# EAGLE design V2_Piezoelectric (EAGLE 9.6.2)
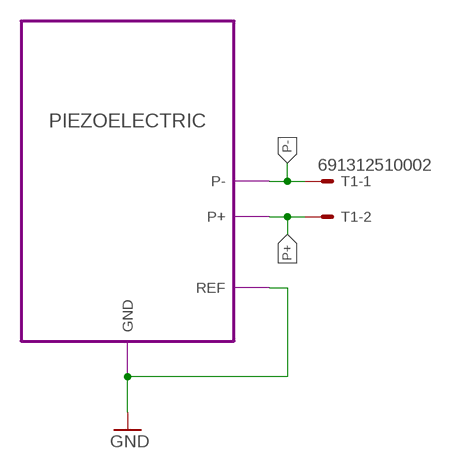
[diagram p0: schematic, sheet 1]

## Parts
T1  691312510002  [691312510002]

## Module instances
PIEZOELECTRIC = PIEZOELECTRIC

## Nets
GND: port PIEZOELECTRIC.GND PIEZOELECTRIC.REF
P+: T1.2 ; port PIEZOELECTRIC.P+
P-: T1.1 ; port PIEZOELECTRIC.P-

## Library data of the parts
T1 = msrm:691312510002: 2 Position Terminal Block Header, Male Pins, Shrouded (2 Side) 0.200" (5.08mm) 90°, Right Angle Through Hole Source: Digikey <https://www.digikey.de/products/de?keywords=732-2064-ND%20> ; Datasheet <https://www.we-online.de/katalog/datasheet/6913125100xx.pdf>; DIGIKEY: 732-2064-ND; PINS: 2

## Module PIEZOELECTRIC
Ports: GND(pwr) P+(io) P-(io) REF(io)
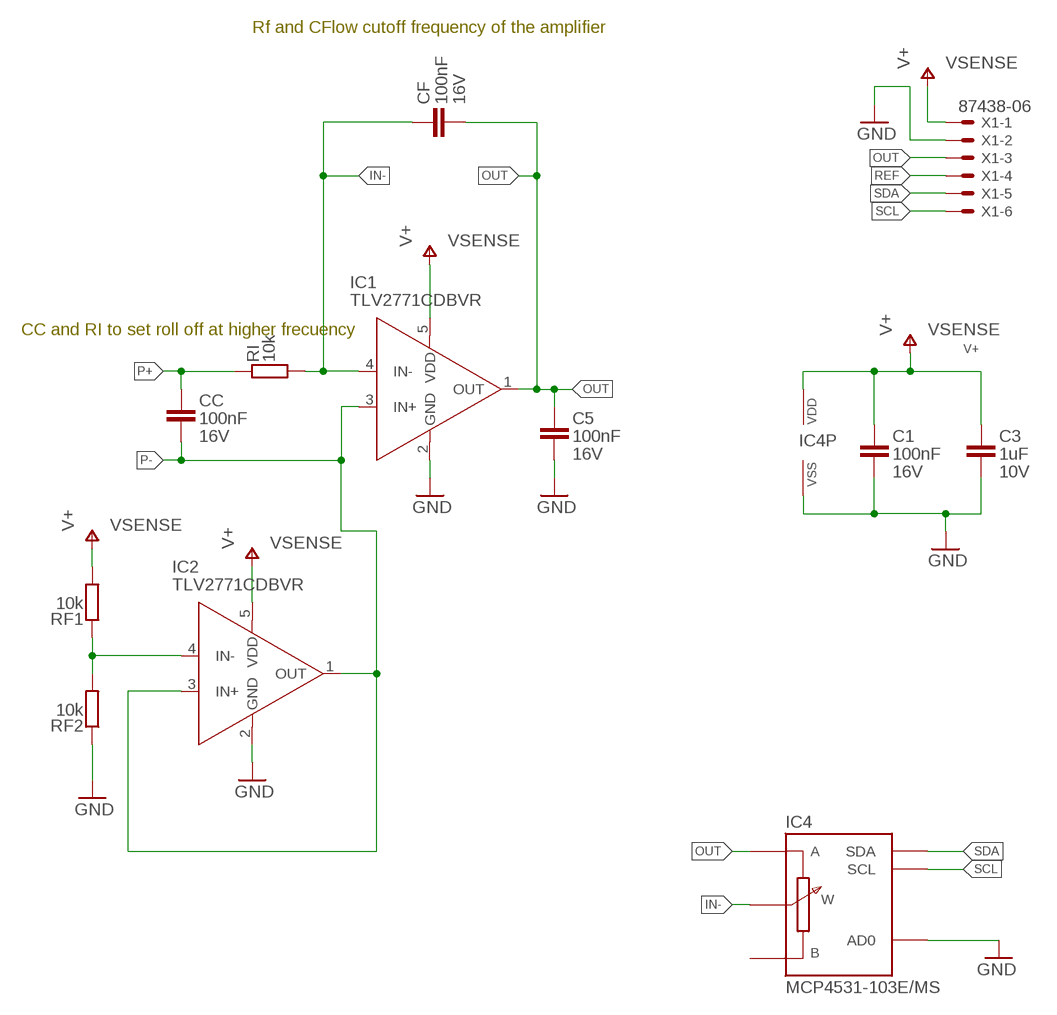
[diagram p1: schematic, module PIEZOELECTRIC, sheet 1]

### Parts
C1  GCM155R71C104JA55  [C0402]
C3  GCM155C7  GCM155C71A105KE38D  [C0402]
C5  GCM155R71C104JA55  [C0402]
CC  GCM155R71C104JA55  [C0402]
CF  GCM155R71C104JA55  [C0402]
IC1  TLV2771CDBVR  [SOT95P280X145-5N]
IC2  TLV2771CDBVR  [SOT95P280X145-5N]
IC4  MCP4531-103E/MS  [MSOP8]
RF1  10k  RT0402FRE0710KL  [R0402]
RF2  10k  RT0402FRE0710KL  [R0402]
RI  10k  RT0402FRE0710KL  [R0402]
X1  87438-06  [87438-06]

### Nets
GND: C1.2 C3.2 C5.2 IC1.2(GND) IC2.2(GND) IC4.1(AD0) IC4.4(VSS) RF2.1 X1.2
IN-: CF.1 IC1.4(IN-) IC4.6(W) RI.2
N$3: IC2.4(IN-) RF1.1 RF2.2
OUT: C5.1 CF.2 IC1.1(OUT) IC4.5(A) X1.3
P+: CC.1 RI.1
P-: CC.2 IC1.3(IN+) IC2.1(OUT) IC2.3(IN+)
REF: X1.4
SCL: IC4.2(SCL) X1.6
SDA: IC4.3(SDA) X1.5
V+ [Power]: C1.1 C3.1 IC1.5(VDD) IC2.5(VDD) IC4.8(VDD) RF1.2 X1.1
Unconnected: IC4.7(B)

### Notes on the sheet
- Rf and CFlow cutoff frequency of the amplifier
- CC and RI to set roll off at higher frecuency

### Library data of the parts
C1 C5 CC CF = msrm:GCM?R7*: Multilayer Ceramic Capacitors Chip Multilayer Ceramic Capacitors for Automotive –55 to 125°C Sources: Catalogue <https://www.murata.com/~/media/webrenewal/support/library/catalog/products/capacitor/mlcc/c03e.ashx?la=en-us> Part Numbering <https://search.murata.co.jp/Ceramy/image/img/A01X/partnumbering_e_02.pdf>; CAPACITANCE: 100nF; DIGIKEY: 490-16433-1-ND; TOLERANCE: ±5%; VOLTAGE: 16V
C3 = msrm:GCM?C7*: Multilayer Ceramic Capacitors Chip Multilayer Ceramic Capacitors for Automotive Sources: Catalogue <https://www.murata.com/~/media/webrenewal/support/library/catalog/products/capacitor/mlcc/c03e.ashx?la=en-us> Part Numbering <https://search.murata.co.jp/Ceramy/image/img/A01X/partnumbering_e_02.pdf>; CAPACITANCE: 1uF; DIGIKEY: 490-13409-1-ND; TOLERANCE: ±10%; VOLTAGE: 10V
IC1 IC2 = msrm:TLV2771CDBVR: Single 2.7-V High Slew Rate Rail-to-Rail Output Operational Amplifier Source: Datasheet <http://www.ti.com/lit/gpn/tlv2771>; DESCRIPTION: Single 2.7-V High Slew Rate Rail-to-Rail Output Operational Amplifier; HEIGHT: 1.45mm; MANUFACTURER_NAME: Texas Instruments; MANUFACTURER_PART_NUMBER: TLV2771CDBVR; MOUSER_PART_NUMBER: 595-TLV2771CDBVR; MOUSER_PRICE-STOCK: https://www.mouser.co.uk/ProductDetail/Texas-Instruments/TLV2771CDBVR?qs=Fg5TsMy7H4uETShD0%252BZIjw%3D%3D
IC4 = msrm:MCP4531-*E/?: Digital Potentiometer I²C Interface Source: Datasheet <http://www.microchip.com/mymicrochip/filehandler.aspx?ddocname=en544078>; DIGIKEY: MCP4531-103E/MS-ND; MEMORY: RAM; POR_WIPER_SETTING: MID SCALE; RESISTANCE: 10k; STEPS: 129; SUPPLY_VOLTAGE: 1.8V to 5.5V; WIPER_LOCK: NO; WIPER_RESISTANCE: 75
RF1 RF2 RI = msrm:RT?FRE07*L: SMD RESISTOR ± 1% Tol, Paper/PE taping reel, 50 ppm/°C, 7 inch dia. Reel Datasheet <http://www.yageo.com/documents/recent/PYu-RT_1-to-0.01_RoHS_L_11.pdf> package: 0201 : 0R ___ Source: Digikey <https://www.digikey.de/products/en?keywords=311-0.0MCT-ND> 1k ___ Source: Digikey <https://www.digikey.de/products/en?keywords=RT0201FRE071KL-ND> 10k ___ Source: Digikey <https://www.digikey.de/products/en?keywords=RT0201FRE0710KL-ND> 100 ___ Source: Digikey <https://www.digikey.de/products/en?keywords=RT0201FRE07100RL-ND> 330 ___ Source: Digikey <https://www.digikey.de/products/en?keywords=RT0201FRE07330RL-ND> package: 0402 : 0R ___ Source: Digikey <https://www.digikey.de/products/en?keywords=311-0.0LRCT-ND> 1k ___ Source: Digikey <https://www.digikey.de/products/en?keywords=%20YAG1234CT-ND> 2k2 ___ Source: Digikey <https://www.digikey.de/products/en?keywords=RT0402FRE072K2L-ND> 2k ___ Source: Digikey <https://www.digikey.de/products/en?keywords=YAG3345CT-ND> 4k7 ___ Source: Digikey <https://www.digikey.de/products/en?keywords=YAG3347CT-ND%20> 10k ___ Source: Digikey <https://www.digikey.de/products/en?keywords=YAG1233CT-ND> 12k1 ___ Source: Digikey <https://www.digikey.de/products/en?keywords=RT0402FRE0712K1L-ND> 49R9 ___ Source: Digikey <https://www.digikey.de/products/en?keywords=YAG3346CT-ND> 56k ___ Source: Digikey <https://www.digikey.de/products/en?keywords=RT0402FRE0756K2L-ND> 100k ___ Source: Digikey <https://www.digikey.de/products/en?keywords=YAG2307CT-ND> 100 ___ Source: Digikey <https://www.digikey.de/products/en?keywords=YAG3342CT-ND> 150 ___ Source: Digikey <https://www.digikey.de/product-detail/en/yageo/RT0402FRE07150RL/13-RT0402FRE07150RLCT-ND/12705162> 300 ___ Source: Digikey <https://www.digikey.de/products/en?keywords=RT0402FRE07300RL-ND> package: 0603 : 0R ___ Source: Digikey <https://www.digikey.de/products/en?keywords=311-0.0HRCT-ND> 1k ___ Source: Digikey <https://www.digikey.de/products/en?keywords=YAG2323CT-ND> 10k ___ Source: Digikey <https://www.digikey.de/products/en?keywords=YAG2321CT-ND> 100k ___ Source: Digikey <https://www.digikey.de/products/en?keywords=YAG2319CT-ND> 100 ___ Source: Digikey <https://www.digikey.de/products/en?keywords=YAG2320CT-ND> 300 ___ Source: Digikey <https://www.digikey.de/products/en?keywords=RT0603FRE07300RL-ND> 330 ___ Source: Digikey <https://www.digikey.de/products/en?keywords=YAG5957CT-ND>; DIGIKEY: YAG1233CT-ND; RVALUE: 10k; SPICEPREFIX: R
X1 = con-molex:87438-06: Wire-to-Board 1.50mm (.059") Pitch Header - Right Angle, SMT, Shrouded Source: http://www.molex.com/product/micro/87438.html; MF: MOLEX; MPN: 87438-0643; OC_FARNELL: 1756938; OC_NEWARK: 88K3155

## Net classes
0 Signal: width 0.152 mm, drill 0.2 mm, clearance 0.152 mm
1 Power: width 0.229 mm, drill 0.2 mm, clearance 0.152 mm

## Board
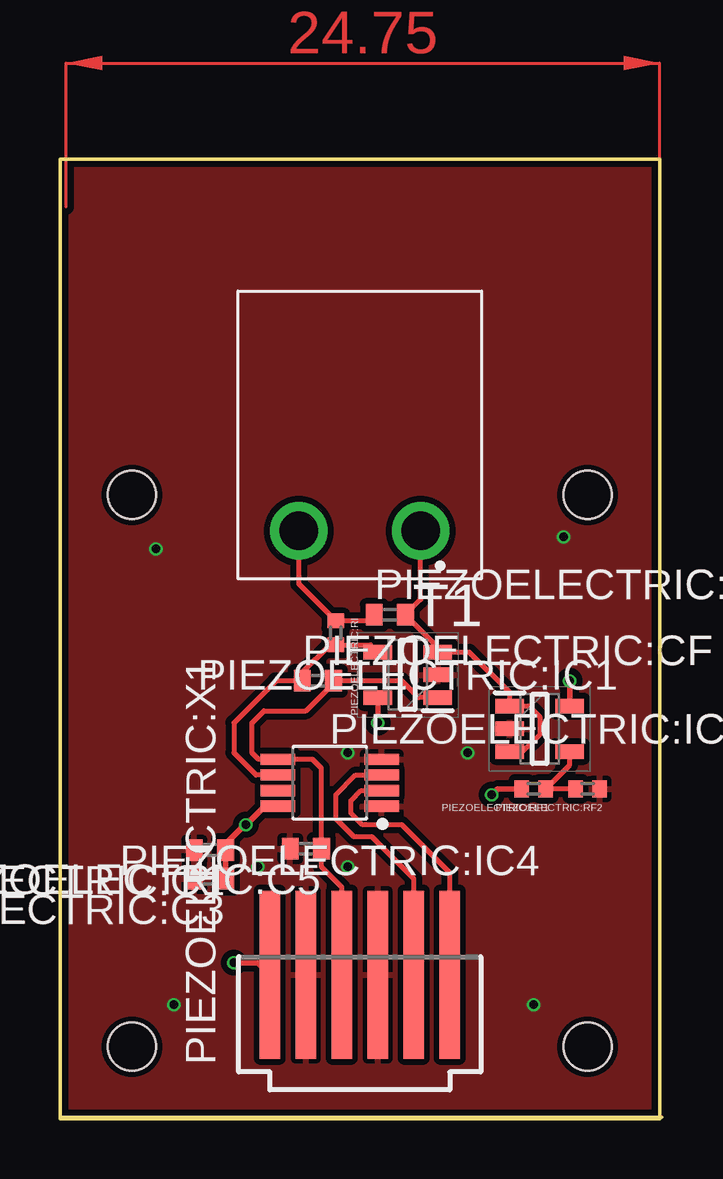
[diagram p2: board, top side]
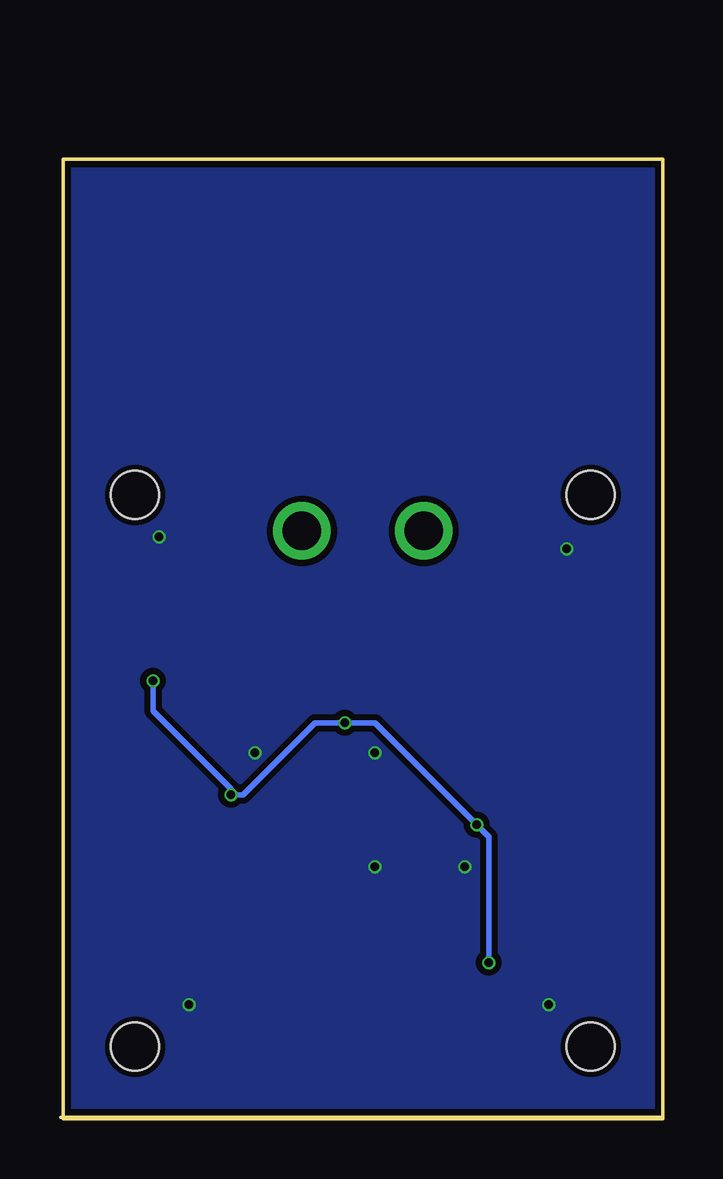
[diagram p3: board, bottom side, seen from below]

Size 25.1 x 40 mm. Coordinates in mm from the lower left corner, seen from the top.
Outline: 0.1,0.05 25.1,0.05
Outline: 0,0 25,0 25,40 0,40 0,0
Copper layers (1*16): Top 0.018mm / dielectric 1.55mm / Bottom 0.018mm
Design rules "Multi-CB_2L_100µm-Tracks_OL35µm": minimum track width 0.1mm, minimum drill 0.2mm, track to track 0.1mm, track to pad 0.1mm, pad to pad 0.1mm, via to via 0.1mm, smd to smd 0mil, copper to edge 0.2mm, drill to drill 0.2mm, minimum pad ring 0.125mm, minimum via ring 0.1mm, stop-mask expansion 2mil, vias tented up to drill 0.45mm, thermal gap 0.2mm
Holes 2 mm at 3,3 22,3 3,26 22,26

### Footprints (pad centres in the part's own frame; a part is rotated, then mirrored left to right if it is on the bottom)
C0402 = smd 0.7 x 0.9: 1 -0.65,0; 2 0.65,0
SOT95P280X145-5N = smd 1.2 x 0.6: 1 -1.25,0.95; 2 -1.25,0; 3 -1.25,-0.95; 4 1.25,-0.95; 5 1.25,0.95
MSOP8 = smd 1.425 x 0.467: 1 -2.164,0.975; 2 -2.164,0.325; 3 -2.164,-0.325; 4 -2.164,-0.975; 5 2.164,-0.975; 6 2.164,-0.325; 7 2.164,0.325; 8 2.164,0.975
R0402 = smd 0.6 x 0.7: 1 -0.5,0; 2 0.5,0
87438-06 = smd 7 x 0.85: 1 0,3.75; 2 0,2.25; 3 0,0.75; 4 0,-0.75; 5 0,-2.25; 6 0,-3.75
691312510002 = drill 1.6: 1 -2.54,4; 2 2.54,4

### Placement (x,y rotation side)
PIEZOELECTRIC:C1  GCM155R71C104JA55  [C0402]  6.25,11.2 180 top
PIEZOELECTRIC:C3  GCM155C7  [C0402]  6.25,10 180 top
PIEZOELECTRIC:C5  GCM155R71C104JA55  [C0402]  10.25,11.25 180 top
PIEZOELECTRIC:CC  GCM155R71C104JA55  [C0402]  13.75,21 0 top
PIEZOELECTRIC:CF  GCM155R71C104JA55  [C0402]  10.75,18.25 0 top
PIEZOELECTRIC:IC1  TLV2771CDBVR  [SOT95P280X145-5N]  14.5,18.5 180 top
PIEZOELECTRIC:IC2  TLV2771CDBVR  [SOT95P280X145-5N]  20,16.25 0 top
PIEZOELECTRIC:IC4  MCP4531-103E/MS  [MSOP8]  11.25,14 180 top
PIEZOELECTRIC:RF1  10k  [R0402]  19.75,13.75 180 top
PIEZOELECTRIC:RF2  10k  [R0402]  22,13.75 180 top
PIEZOELECTRIC:RI  10k  [R0402]  11.5,20.25 270 top
PIEZOELECTRIC:X1  87438-06  [87438-06]  12.5,6 90 top
T1  12.5,28.5 180 top

### Tracks (layer width: path | path; a pad name or v marks a point on that pad's centre or on a via)
GND  (via drill 0.35)
  other vias: 17,15.25 21,24.25 19.75,4.75 4.75,4.75 4,23.75 12,15.25 12,10.5 8.25,10.5
  pour Top (isolate 0.254, rank 6): 0,0 0,40 25,40 25,0
  pour Bottom (isolate 0.254, rank 6): 0,0 0,40 25,40 25,0
P+
  Top 0.2: T1.2 9.96,22.29 PIEZOELECTRIC:RI.1 12.85,20.75 PIEZOELECTRIC:CC.1
P-
  Top 0.2: T1.1 15.04,21.64 PIEZOELECTRIC:CC.2 15.75,19.65 PIEZOELECTRIC:IC1.3 17.06,19.45 18.75,17.76 PIEZOELECTRIC:IC2.1 19.55,17.2 20,16.75 20,16 19.3,15.3 PIEZOELECTRIC:IC2.3
PIEZOELECTRIC:IN-
  Top 0.2: PIEZOELECTRIC:IC4.6 8.18,14.32 7.25,15.25 7.25,16.5 9,18.25 PIEZOELECTRIC:CF.1 10.1,18.6 11.25,19.75 PIEZOELECTRIC:RI.2 12.95,19.75 PIEZOELECTRIC:IC1.4
PIEZOELECTRIC:N$3
  Top 0.2: PIEZOELECTRIC:RF2.2 PIEZOELECTRIC:RF1.1 21.25,14.75 PIEZOELECTRIC:IC2.4
PIEZOELECTRIC:OUT
  Top 0.2: PIEZOELECTRIC:IC1.1 14.95,17.55 14.25,18.25 PIEZOELECTRIC:CF.2 11.4,18.15 10.25,17 8.5,17 8,16.5 8,15.25 8.28,14.97 PIEZOELECTRIC:IC4.5 10.53,14.97 10.9,14.6 PIEZOELECTRIC:C5.1 10.9,10.5 11.75,9.65 PIEZOELECTRIC:X1.3
PIEZOELECTRIC:SCL
  Top 0.2: PIEZOELECTRIC:X1.6 16.25,10.25 14.25,12.25 12.62,12.25 12.13,12.74 12.13,13.25 12.56,13.68 PIEZOELECTRIC:IC4.2
PIEZOELECTRIC:SDA
  Top 0.2: PIEZOELECTRIC:X1.5 14.75,10 13,11.75 12.25,11.75 11.5,12.5 11.5,13.5 12.32,14.32 PIEZOELECTRIC:IC4.3
PIEZOELECTRIC:V+  (via drill 0.35)
  Top 0.229: PIEZOELECTRIC:IC4.8 8.53,13.03 v7.75,12.25 7.7,12.25 6.9,11.45 PIEZOELECTRIC:C1.1 PIEZOELECTRIC:C3.1 | PIEZOELECTRIC:X1.1 8.25,6.5 v7.25,6.5 | v13.25,16.5 PIEZOELECTRIC:IC1.5 | v18,13.5 18.25,13.75 PIEZOELECTRIC:RF1.2 | PIEZOELECTRIC:IC2.5 v21.25,18.25
  Bottom 0.229: v21.25,18.25 21.25,17 18,13.75 v18,13.5 17.5,13.5 14.5,16.5 v13.25,16.5 12,16.5 v7.75,12.25 7.25,11.75 v7.25,6.5
(copper drawn outside any net)
  shapes: Top area x2